# Altium schematic sheet Communication.SchDoc
size A4; SheetNumber: 2; SheetTotal: 6
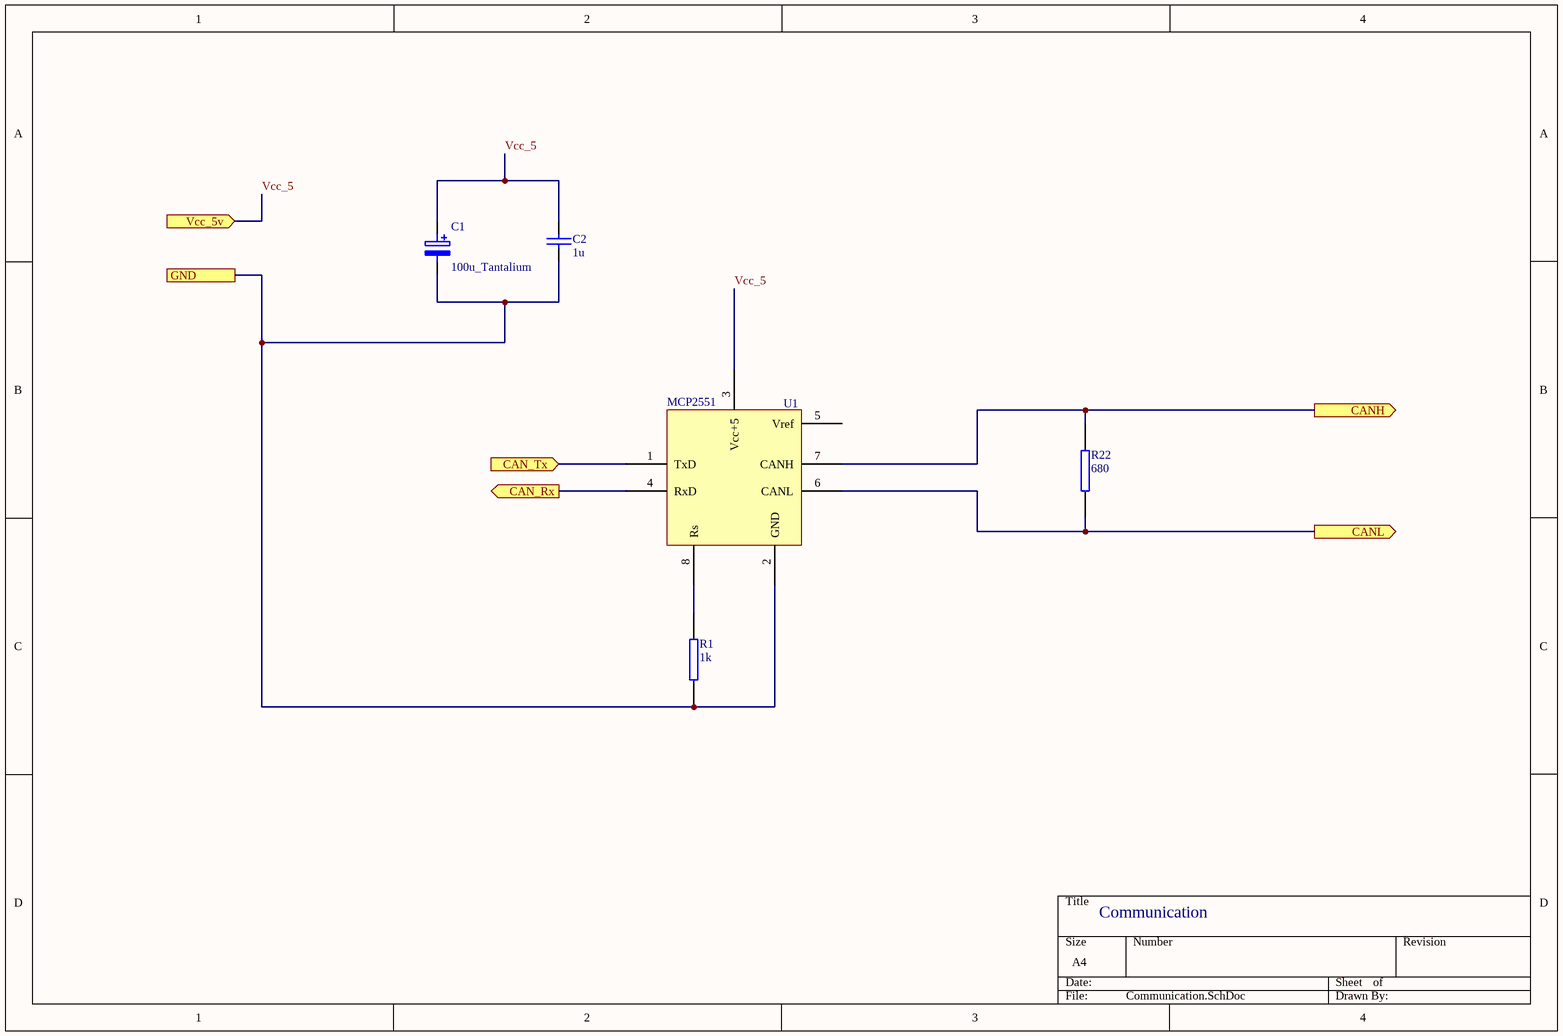
[diagram p0: Communication.SchDoc]

## Parts
C1  100u_Tantalium  [Tantalum_9545]
C2  1u  [1206_SMD]
R1  1k  [1206_SMD]
R22  680  [1206_SMD]
U1  MCP2551  [SOIC8]

## Ports
CAN_Rx (out), CAN_Tx (in), CANH (out), CANL (out), GND, Vcc_5v (in)

## Nets
CAN_Rx: U1.4(RxD) ; port CAN_Rx
CAN_Tx: U1.1(TxD) ; port CAN_Tx
CANH: R22.2 U1.7(CANH) ; port CANH
CANL: R22.1 U1.6(CANL) ; port CANL
GND: C1.2 C2.2 R1.1 U1.2(GND) ; port GND
Vcc_5: C1.1 C2.1 U1.3(Vcc+5) ; port Vcc_5v
NetR1_2: R1.2 U1.8(Rs)

Not connected (* = marked no-connect by the designer): U1 5(Vref)

## Notes on the sheet
- Communication

## Library data of the parts
C1 = CAP_ELECTRO
C2 = CAP: Capacitor
R1 R22 = RES2
U1 = CAN_Interface